# EAGLE design Evaluation_Board (EAGLE 6.5.0)
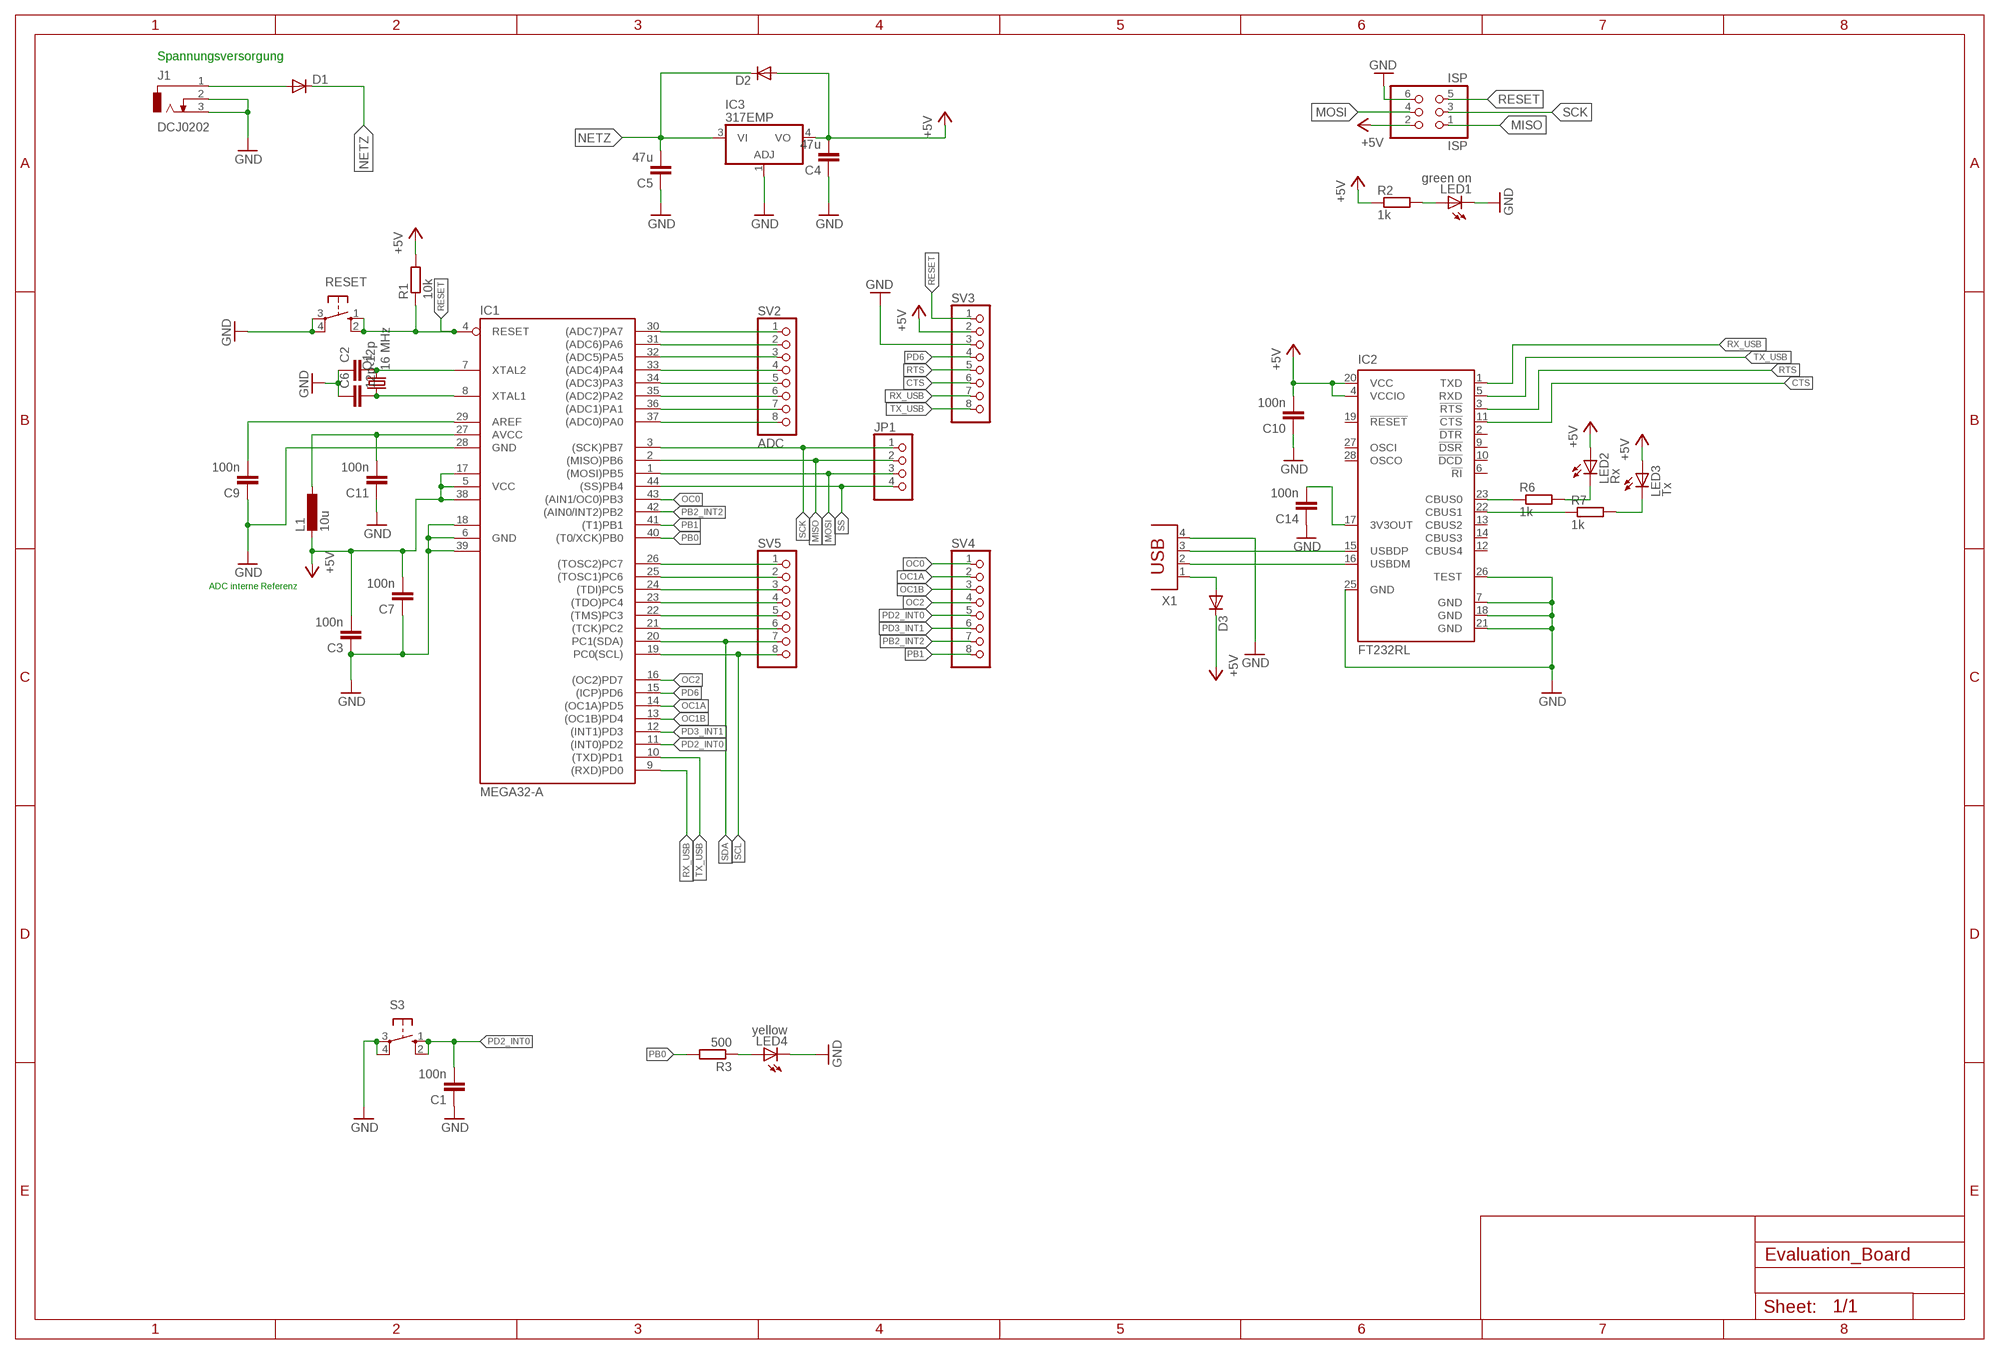
[diagram p0: schematic, sheet 1]

## Parts
C1  100n  C-EUC0805  [C0805]
C2  12p  C-EUC0805  [C0805]
C3  100n  C-EUC0805  [C0805]
C4  47u  C-EUC0805  [C0805]
C5  47u  C-EUC0805  [C0805]
C6  12p  C-EUC0805  [C0805]
C7  100n  C-EUC0805  [C0805]
C9  100n  C-EUC0805  [C0805]
C10  100n  C-EUC0805  [C0805]
C11  100n  C-EUC0805  [C0805]
C14  100n  C-EUC0805  [C0805]
D1  DIODE-MINIMELF  [MINIMELF]
D2  DIODE-MINIMELF  [MINIMELF]
D3  DIODE-MINIMELF  [MINIMELF]
IC1  MEGA32-A  [TQFP44]
IC2  FT232RL  [SSOP28]
IC3  317EMP  [SOT223]
ISP  ISP  PINHD-2X3  [2X03]
J1  DCJ0202  [DCJ0202]
JP1  PINHD-1X4  [1X04]
L1  10u  L-EUL3225M  [L3225M]
LED1  green on  LEDSML0805  [SML0805]
LED2  Rx  LEDSML0805  [SML0805]
LED3  Tx  LEDSML0805  [SML0805]
LED4  yellow  LEDSML0805  [SML0805]
Q1  16 MHz  CRYSTALHC49UP  [HC49UP]
R1  10k  R-EU_R0805  [R0805]
R2  1k  R-EU_R0805  [R0805]
R3  500  R-EU_R0805  [R0805]
R6  1k  R-EU_R0805  [R0805]
R7  1k  R-EU_R0805  [R0805]
RESET  10-XX  [B3F-10XX]
S3  10-XX  [B3F-10XX]
SV2  ADC  PINHD-1X8  [1X08]
SV3  PINHD-1X8  [1X08]
SV4  PINHD-1X8  [1X08]
SV5  PINHD-1X8  [1X08]
X1  USB-B-BUCHSE-HORIZONTAL  [USB-B-BUCHSE-HORIZONTAL]

## Nets
+5V: C3.2 C4.2 C7.2 C10.2 D2.A D3.C IC1.5(VCC) IC1.17(VCC1) IC1.38(VCC2) IC2.4(VCCIO) IC2.20(VCC) IC3.4(VO) ISP.2 L1.2 LED2.A LED3.A R1.2 R2.1 SV3.2
A0: IC1.37((ADC0)PA0) SV2.8
A1: IC1.36((ADC1)PA1) SV2.7
A2: IC1.35((ADC2)PA2) SV2.6
A3: IC1.34((ADC3)PA3) SV2.5
A4: IC1.33((ADC4)PA4) SV2.4
A5: IC1.32((ADC5)PA5) SV2.3
A6: IC1.31((ADC6)PA6) SV2.2
A7: IC1.30((ADC7)PA7) SV2.1
C2: IC1.21((TCK)PC2) SV5.6
C3: IC1.22((TMS)PC3) SV5.5
C4: IC1.23((TDO)PC4) SV5.4
C5: IC1.24((TDI)PC5) SV5.3
C6: IC1.25((TOSC1)PC6) SV5.2
C7: IC1.26((TOSC2)PC7) SV5.1
CTS: IC2.11(!CTS) SV3.6
GND: C1.1 C2.1 C3.1 C4.1 C5.1 C6.1 C7.1 C9.1 C10.1 C11.1 C14.1 IC1.6(GND) IC1.18(GND1) IC1.28(GND) IC1.39(GND2) IC2.7(GND) IC2.18(GND) IC2.21(GND) IC2.25(GND) IC2.26(TEST) IC3.1(ADJ) ISP.6 J1.2 J1.3 LED1.C LED4.C RESET.3(P) RESET.4(P1) S3.3(P) S3.4(P1) SV3.3 X1.4
MISO: IC1.2((MISO)PB6) ISP.1 JP1.2
MOSI: IC1.1((MOSI)PB5) ISP.4 JP1.3
N$1: D3.A X1.1
N$2: D1.A J1.1
N$4: IC2.23(CBUS0) R6.1
N$5: LED1.A R2.2
N$14: LED2.C R6.2
N$15: IC2.22(CBUS1) R7.1
N$16: LED3.C R7.2
N$17: C2.2 IC1.7(XTAL2) Q1.2
N$18: IC2.15(USBDP) X1.3
N$19: IC2.16(USBDM) X1.2
N$20: C14.2 IC2.17(3V3OUT)
N$25: C6.2 IC1.8(XTAL1) Q1.1
N$26: LED4.A R3.1
N$28: C9.2 IC1.29(AREF)
N$30: C11.2 IC1.27(AVCC) L1.1
NETZ: C5.2 D1.C D2.C IC3.3(VI)
OC0: IC1.43((AIN1/OC0)PB3) SV4.1
OC1A: IC1.14((OC1A)PD5) SV4.2
OC1B: IC1.13((OC1B)PD4) SV4.3
OC2: IC1.16((OC2)PD7) SV4.4
PB0: IC1.40((T0/XCK)PB0) R3.2
PB1: IC1.41((T1)PB1) SV4.8
PB2_INT2: IC1.42((AIN0/INT2)PB2) SV4.7
PD2_INT0: C1.2 IC1.11((INT0)PD2) S3.1(S) S3.2(S1) SV4.5
PD3_INT1: IC1.12((INT1)PD3) SV4.6
PD6: IC1.15((ICP)PD6) SV3.4
RESET: IC1.4(RESET) ISP.5 R1.1 RESET.1(S) RESET.2(S1) SV3.1
RTS: IC2.3(!RTS) SV3.5
RX_USB: IC1.9((RXD)PD0) IC2.1(TXD) SV3.7
SCK: IC1.3((SCK)PB7) ISP.3 JP1.1
SCL: IC1.19(PC0(SCL)) SV5.8
SDA: IC1.20(PC1(SDA)) SV5.7
SS: IC1.44((SS)PB4) JP1.4
TX_USB: IC1.10((TXD)PD1) IC2.5(RXD) SV3.8
Unconnected: IC2.2(!DTR) IC2.6(!RI) IC2.9(!DSR) IC2.10(!DCD) IC2.12(CBUS4) IC2.13(CBUS2) IC2.14(CBUS3) IC2.19(!RESET) IC2.27(OSCI) IC2.28(OSCO)

## Notes on the sheet
- Spannungsversorgung
- ADC interne Referenz

## Library data of the parts
C1-C7 C9-C11 C14 = rcl:C-EU: CAPACITOR, European symbol
D1-D3 = diode:DIODE-: DIODE
IC1 = atmel:MEGA32: MICROCONTROLLER 32 Kbytes FLASH 2 Kbytes SRAM 1 Kbytes EEPROM USART 8-channel 10 bit ADC Source: www.atmel.com .. doc2503.pdf; MPN: ATMEGA32-16AU; OC_FARNELL: 9171274; OC_NEWARK: 69K6677
IC2 = ftdichip:FT232R: Source: http://www.ftdichip.com/Documents/DataSheets/DS_FT232R_v104.pdf; MPN: FT232RL; OC_FARNELL: 1146032; OC_NEWARK: 91K9918
IC3 = linear:*317: Positive VOLTAGE REGULATOR
ISP = pinhead:PINHD-2X3: PIN HEADER
J1 = con-jack:DCJ0202: DC POWER JACK Source: DCJ0202.pdf; OC_FARNELL: unknown; OC_NEWARK: unknown
JP1 = pinhead:PINHD-1X4: PIN HEADER
L1 = rcl:L-EU: INDUCTOR, European symbol
LED1-LED4 = led:LED: LED OSRAM: - CHIPLED LG R971, LG N971, LY N971, LG Q971, LY Q971, LO R971, LY R971 LH N974, LH R974 LS Q976, LO Q976, LY Q976 LO Q996 - Hyper CHIPLED LW Q18S LB Q993, LB Q99A, LB R99A - SideLED LS A670, LO A670, LY A670, LG A670, LP A670 LB A673, LV A673, LT A673, LW A673 LH A674 LY A675 LS A676, LA A676, LO A676, LY A676, LW A676 LS A679, LY A679, LG A679 - Hyper Micro SIDELED® LS Y876, LA Y876, LO Y876, LY Y876 LT Y87S - SmartLED LW L88C, LW L88S LB L89C, LB L89S, LG L890 LS L89K, LO L89K, LY L89K LS L896, LA L896, LO L896, LY L896 - TOPLED LS T670, LO T670, LY T670, LG T670, LP T670 LSG T670, LSP T670, LSY T670, LOP T670, LYG T670 LG T671, LOG T671, LSG T671 LB T673, LV T673, LT T673, LW T673 LH T674 LS T676, LA T676, LO T676, LY T676, LB T676, LH T676, LSB T676, LW T676 LB T67C, LV T67C, LT T67C, LS T67K, LO T67K, LY T67K, LW E67C LS E67B, LA E67B, LO E67B, LY E67B, LB E67C, LV E67C, LT E67C LW T67C LS T679, LY T679, LG T679 LS T770, LO T770, LY T770, LG T770, LP T770 LB T773, LV T773, LT T773, LW T773 LH T774 LS E675, LA E675, LY E675, LS T675 LS T776, LA T776, LO T776, LY T776, LB T776 LHGB T686 LT T68C, LB T68C - Hyper Mini TOPLED® LB M676 - Mini TOPLED Santana® LG M470 LS M47K, LO M47K, LY M47K Source: http://www.osram.convergy.de LUXEON: - LUMILED® LXK2-PW12-R00, LXK2-PW12-S00, LXK2-PW14-U00, LXK2-PW14-V00 LXK2-PM12-R00, LXK2-PM12-S00, LXK2-PM14-U00 LXK2-PE12-Q00, LXK2-PE12-R00, LXK2-PE12-S00, LXK2-PE14-T00, LXK2-PE14-U00 LXK2-PB12-K00, LXK2-PB12-L00, LXK2-PB12-M00, LXK2-PB14-N00, LXK2-PB14-P00, LXK2-PB14-Q00 LXK2-PR12-L00, LXK2-PR12-M00, LXK2-PR14-Q00, LXK2-PR14-R00 LXK2-PD12-Q00, LXK2-PD12-R00, LXK2-PD12-S00 LXK2-PH12-R00, LXK2-PH12-S00 LXK2-PL12-P00, LXK2-PL12-Q00, LXK2-PL12-R00 Source: www.luxeon.com KINGBRIGHT: KA-3528ASYC Source: www.kingbright.com
Q1 = crystal:CRYSTAL: CRYSTAL; OC_FARNELL: unknown; OC_NEWARK: unknown
R1-R3 R6 R7 = rcl:R-EU_: RESISTOR, European symbol
RESET S3 = switch-omron:10-XX: OMRON SWITCH; MPN: B3F-1000; OC_FARNELL: 176432; OC_NEWARK: 36M3542
SV2-SV5 = pinhead:PINHD-1X8: PIN HEADER
X1 = EmbeddedProjectsBauteile:USB-B-BUCHSE-HORIZONTAL: liegende Ausführung

## Board
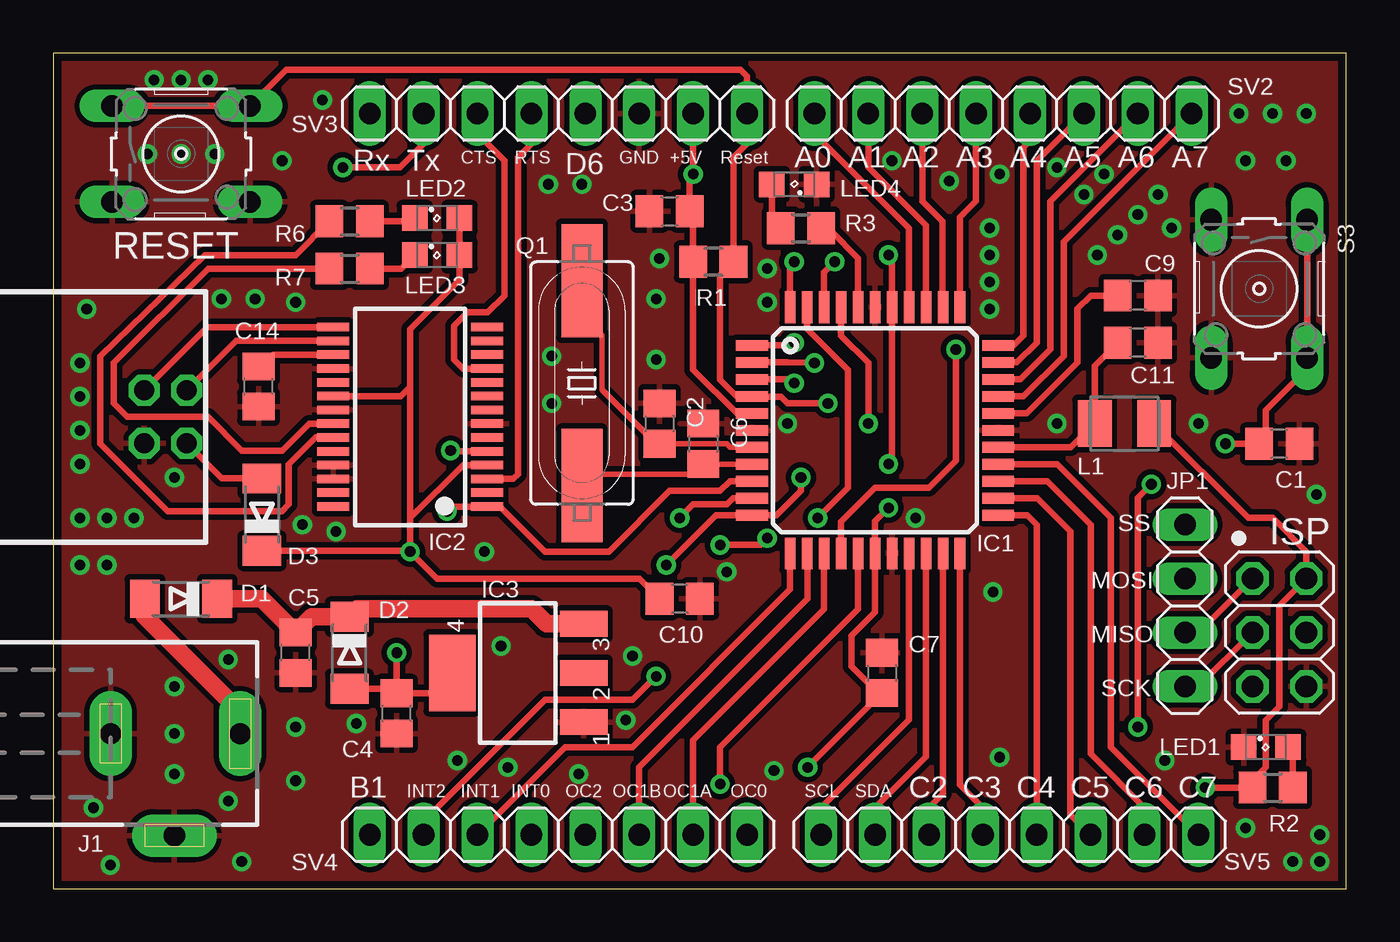
[diagram p1: board, top side]
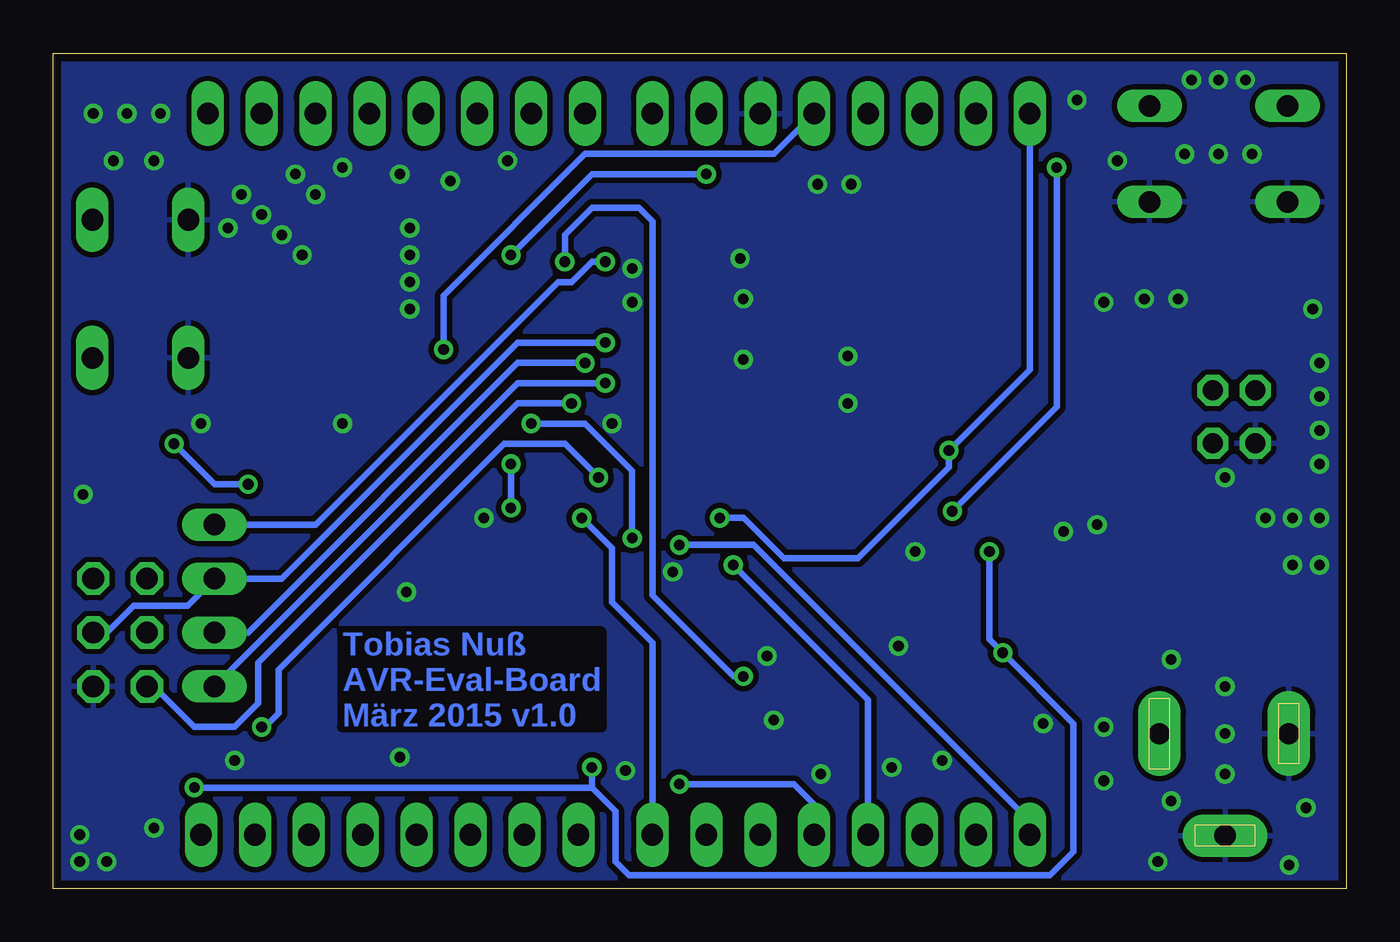
[diagram p2: board, bottom side, seen from below]

Size 60.95 x 39.36 mm. Coordinates in mm from the lower left corner, seen from the top.
Outline: 0,0 60.95,0 60.95,39.36 0,39.36 0,0
Copper layers (1*16): Top 0.035mm / dielectric 1.5mm / Bottom 0.035mm
Design rules "osh-park": minimum track width 6mil, minimum drill 13mil, track to track 6mil, track to pad 6mil, pad to pad 8mil, via to via 8mil, smd to smd 8mil, copper to edge 15mil, drill to drill 7mil, minimum pad ring 10mil, minimum via ring 8mil, stop-mask expansion 4mil, vias tented up to drill 0mil, thermal gap 10mil

### Footprints (pad centres in the part's own frame; a part is rotated, then mirrored left to right if it is on the bottom)
C0805 = smd 1.3 x 1.5: 1 -0.95,0; 2 0.95,0
MINIMELF = smd 1.4 x 1.8: A 1.7,0; C -1.7,0
TQFP44 = smd 1.5 x 0.5: 1 -5.8,4; 2 -5.8,3.2; 3 -5.8,2.4; 4 -5.8,1.6; 5 -5.8,0.8; 6 -5.8,0; 7 -5.8,-0.8; 8 -5.8,-1.6; 9 -5.8,-2.4; 10 -5.8,-3.2; 11 -5.8,-4; 23 5.8,-4; 24 5.8,-3.2; 25 5.8,-2.4; 26 5.8,-1.6; 27 5.8,-0.8; 28 5.8,0; 29 5.8,0.8; 30 5.8,1.6; 31 5.8,2.4; 32 5.8,3.2; 33 5.8,4 | smd 0.5 x 1.5: 12 -4,-5.8; 13 -3.2,-5.8; 14 -2.4,-5.8; 15 -1.6,-5.8; 16 -0.8,-5.8; 17 0,-5.8; 18 0.8,-5.8; 19 1.6,-5.8; 20 2.4,-5.8; 21 3.2,-5.8; 22 4,-5.8; 34 4,5.8; 35 3.2,5.8; 36 2.4,5.8; 37 1.6,5.8; 38 0.8,5.8; 39 0,5.8; 40 -0.8,5.8; 41 -1.6,5.8; 42 -2.4,5.8; 43 -3.2,5.8; 44 -4,5.8
SSOP28 = smd 0.4 x 1.5: 1 -4.225,-3.625; 2 -3.575,-3.625; 3 -2.925,-3.625; 4 -2.275,-3.625; 5 -1.625,-3.625; 6 -0.975,-3.625; 7 -0.325,-3.625; 8 0.325,-3.625; 9 0.975,-3.625; 10 1.625,-3.625; 11 2.275,-3.625; 12 2.925,-3.625; 13 3.575,-3.625; 14 4.225,-3.625; 15 4.225,3.625; 16 3.575,3.625; 17 2.925,3.625; 18 2.275,3.625; 19 1.625,3.625; 20 0.975,3.625; 21 0.325,3.625; 22 -0.325,3.625; 23 -0.975,3.625; 24 -1.625,3.625; 25 -2.275,3.625; 26 -2.925,3.625; 27 -3.575,3.625; 28 -4.225,3.625
SOT223 = smd 1.219 x 2.235: 1 -2.311,-3.099; 2 0,-3.099; 3 2.311,-3.099 | smd 3.6 x 2.2: 4 0,3.099
2X03 = drill 1.016 octagon: 1 -2.54,-1.27; 2 -2.54,1.27; 3 0,-1.27; 4 0,1.27; 5 2.54,-1.27; 6 2.54,1.27
DCJ0202 = drill 1 pad 2 long: 1 0,3.1; 2 4.8,0; 3 0,-3
1X04 = drill 1.016 long: 1 -3.81,0; 2 -1.27,0; 3 1.27,0; 4 3.81,0
L3225M = smd 1.6 x 2.2: 1 -1.4,0; 2 1.4,0
SML0805 = smd 1.2 x 1.2: A 1.05,0; C -1.05,0
HC49UP = smd 5.334 x 1.93: 1 -4.826,0; 2 4.826,0
R0805 = smd 1.3 x 1.5: 1 -0.95,0; 2 0.95,0
B3F-10XX = drill 1.016 long: 1 -3.251,2.261; 2 3.251,2.261; 3 -3.251,-2.261; 4 3.251,-2.261
1X08 = drill 1.016 long: 1 -8.89,0; 2 -6.35,0; 3 -3.81,0; 4 -1.27,0; 5 1.27,0; 6 3.81,0; 7 6.35,0; 8 8.89,0
USB-B-BUCHSE-HORIZONTAL = drill 0.95 octagon: 1 1.25,9.79; 2 -1.25,9.79; 3 -1.25,7.79; 4 1.25,7.79

### Placement (x,y rotation side)
C1  57.78,20.95 180 top
C2  28.57,21.91 270 top
C3  29.05,31.91 0 top
C4  16.19,8.26 90 top
C5  11.43,11.11 90 top
C6  30.64,20.95 270 top
C7  39.05,10.16 270 top
C9  51.12,27.94 180 top
C10  29.53,13.65 180 top
C11  51.12,25.72 180 top
C14  9.68,23.65 90 top
D1  6.03,13.65 180 top
D2  13.97,11.11 270 top
D3  9.84,17.62 90 top
IC1  38.73,21.59 0 top
IC2  16.83,22.23 90 top
IC3  21.91,10.16 90 top
ISP  57.78,12.06 270 top
J1  5.71,7.3 270 top
JP1  53.34,13.34 90 top
L1  50.48,21.91 0 top
LED1  57.15,6.67 0 top
LED2  18.1,31.59 0 top
LED3  18.1,29.84 0 top
LED4  34.92,33.18 180 top
Q1  24.92,23.81 90 top
R1  31.11,29.53 180 top
R2  57.47,4.76 0 top
R3  35.24,31.11 0 top
R6  13.97,31.43 0 top
R7  13.97,29.21 0 top
RESET  6.03,34.61 0 top
S3  56.83,28.26 270 top
SV2  44.77,36.51 180 top
SV3  23.81,36.51 180 top
SV4  23.81,2.54 180 top
SV5  45.09,2.54 180 top
X1  -3.49,22.23 270 top

### Tracks (layer width: path | path; a pad name or v marks a point on that pad's centre or on a via)
+5V  (via drill 0.5)
  Top 0.305: IC2.4 19.32,19.95 16.83,17.46 | 16.83,17.46 v16.83,15.88 | LED2.A LED3.A 19.15,28.67 16.83,26.35 16.83,23.65 | 16.83,23.65 16.83,17.46 | L1.2 56.33,17.46 57.47,17.46 59.05,15.88 ISP.2 57.78,13.34 57.78,8.57 57.15,7.94 57.15,5.71 56.52,5.08 R2.1 v54.29,4.76 | v39.37,17.94 38.73,17.3 IC1.17 38.73,13.02 37.62,11.91 37.62,10.48 38.42,9.68 38.58,9.68 C7.2 38.73,8.89 v35.56,5.71 | v39.37,20 39.53,20.17 IC1.38 39.53,29.68 v39.37,29.84 | IC1.5 32.22,22.39 30.16,24.45 R1.2 30.16,31.75 C3.2 | SV3.2 v30.16,33.66 30,33.49 C3.2 | C4.2 17.85,9.21 IC3.4 | IC2.20 16.37,23.2 16.83,23.65 | D2.A 15.98,9.41 C4.2 | D3.C 16.78,15.92 v16.83,15.88 | v16.19,11.11 C4.2 | v16.83,15.88 18.1,14.61 27.62,14.61 C10.2 | 30.16,31.75 C3.2
  Bottom 0.305: 35.56,4.76 v54.29,4.76 | v30.16,33.66 35.56,33.66 v39.37,29.84 | v39.37,17.94 v39.37,20 | v16.83,15.88 16.83,11.75 v16.19,11.11 12.86,7.78 12.86,1.75 13.97,0.64 33.81,0.64 34.45,1.27 34.45,3.65 35.56,4.76 | v35.56,5.71 35.56,4.76
A0
  Top 0.305: SV2.8 35.88,35.56 40.32,31.11 40.32,27.4 IC1.37
A1
  Top 0.305: SV2.7 38.42,33.97 41.13,31.25 IC1.36
A2
  Top 0.305: SV2.6 40.96,32.38 41.91,31.43 41.91,27.41 IC1.35
A3
  Top 0.305: SV2.5 43.5,32.38 42.73,31.62 IC1.34
A4
  Top 0.305: SV2.4 46.04,35.24 45.72,34.92 45.72,26.04 45.27,25.59 IC1.33
A5
  Top 0.305: IC1.32 45.43,24.79 46.35,25.72 46.35,34.29 SV2.3
A6
  Top 0.305: IC1.31 45.58,23.99 46.99,25.4 46.99,32.38 SV2.2
A7
  Top 0.305: IC1.30 45.73,23.19 47.62,25.08 47.62,30.48 SV2.1
C2
  Top 0.305: SV5.6 41.27,3.81 41.94,4.47 IC1.21
C3
  Top 0.305: IC1.22 42.73,4.89 43.81,3.81 SV5.5
C4
  Top 0.305: IC1.23 45.91,17.59 46.35,17.14 SV5.4
C5
  Top 0.305: IC1.24 46.38,18.39 47.94,16.83 47.94,3.49 SV5.3
C6
  Top 0.305: IC1.25 46.85,19.19 48.9,17.14 48.9,6.35 51.44,3.81 SV5.2
C7
  Top 0.305: IC1.26 47.32,19.99 49.85,17.46 49.85,6.67 SV5.1
CTS
  Top 0.305: IC2.11 19.32,24.5 18.89,24.92 18.89,26.51 19.53,27.15 20.48,27.15 21.27,27.94 21.27,34.29 20,35.56 SV3.6
GND  (via drill 0.5)
  other vias: 11.43,7.62 11.43,5.08 11.75,17.14 7.94,27.78 9.53,27.78 11.43,27.62 44.13,27.3 44.13,28.57 44.13,29.84 44.13,31.11 42.23,33.34 39.53,34.29 48.58,32.7 47.31,33.97 47.31,21.91 52.39,6.03 24.77,5.4 21.43,5.71 53.98,21.91 49.21,29.84 50.16,30.8 51.12,31.75 52.07,32.7 52.7,31.11 55.88,36.51 56.2,34.29 58.1,34.29 59.05,36.51 57.47,36.51 56.2,2.86 2.7,1.11 5.71,9.53 5.71,5.4 5.71,7.3 5.71,19.37 4.45,34.61 6.03,34.61 7.62,34.61 10.79,34.29 12.7,37.15 1.59,27.3 1.27,24.77 1.27,23.18 1.27,21.59 1.27,17.46 3.81,17.46 1.27,20 2.54,17.46 8.26,10.79 8.26,4.13 1.91,3.81 19.05,6.03 26.99,7.94 27.3,10.95 33.66,29.21 44.61,33.66 49.53,33.66 59.53,18.57 59.69,2.54 59.69,1.27 58.42,1.27 8.89,1.27 14.29,7.78 1.27,15.24 2.54,15.24 13.34,16.83 4.76,38.1 6.03,38.1 7.3,38.1 33.66,27.62 31.75,14.92 34.61,21.91 40.64,17.46 28.42,24.92 28.42,27.78 28.57,29.69 23.5,25.08 23.5,22.86 20.32,15.88 23.34,33.18 24.92,33.18 21.11,11.43 44.29,13.97 33.97,5.56 44.61,6.19
  pour Bottom (isolate 0.254): 0,39.37 60.96,39.37 60.96,0 0,0
  pour Top (isolate 0.254): 0,39.37 60.96,39.37 60.96,0 0,0
MISO  (via drill 0.5)
  Top 0.305: JP1.2 53.98,12.06 ISP.1 | IC1.2 34.58,24.79 v35.88,24.77
  Bottom 0.305: JP1.2 51.75,12.06 39.05,24.77 v35.88,24.77
MOSI  (via drill 0.5)
  Top 0.305: IC1.1 34.8,25.59 v34.92,25.72
  Bottom 0.305: ISP.4 58.42,12.06 57.15,13.34 54.61,13.34 JP1.3 50.16,14.61 39.05,25.72 v34.92,25.72
N$1
  Top 0.305: D3.A 7.95,19.32 X1.1
N$2
  Top 0.813: J1.1 8.81,8.33 4.29,12.86 4.29,13.61 D1.A
N$4
  Top 0.305: R6.1 11.43,29.84 7.14,29.84 2.22,25.08 2.22,20.95 5.4,17.78 10.79,17.78 11.11,18.1 11.11,20 12.38,21.27 13.18,21.27 IC2.23
N$5
  Top 0.305: R2.2 58.42,6.45 LED1.A
N$14
  Top 0.305: R6.2 16.89,31.43 LED2.C
N$15
  Top 0.305: R7.1 7.3,29.21 2.86,24.77 2.86,22.86 3.49,22.23 7.3,22.23 8.89,20.64 10.79,20.64 12.06,21.91 IC2.22
N$16
  Top 0.305: R7.2 16.41,29.21 LED3.C
N$17
  Top 0.254: 28.58,20.79 C2.2 | C2.2 28.41,20.96 25.88,23.5 25.88,26.04 25.4,26.51 25.4,28.16 Q1.2 | C2.2 31.75,20.96 31.91,20.8 IC1.7
N$18
  Top 0.305: X1.3 7.27,26.45 IC2.15
N$19
  Top 0.305: X1.2 8.62,25.8 IC2.16
N$20
  Top 0.305: IC2.17 10.39,25.15 C14.2
N$25
  Top 0.254: IC1.8 30.94,19.99 C6.2 30.8,19.68 30.64,19.53 25.46,19.53 Q1.1
N$26
  Top 0.305: R3.1 33.88,31.85 LED4.A
N$28
  Top 0.305: IC1.29 45.88,22.39 48.26,24.77 48.26,27.3 48.9,27.94 C9.2
N$30
  Top 0.305: IC1.27 47.97,20.79 L1.1 49.08,24.63 C11.2
NETZ
  Top 0.305: 25.72,12.38 25.63,12.47 IC3.3 | 13.77,13.02 D2.C 14.18,13.02
  Top 0.813: D1.C 9.84,13.65 C5.2 12.18,12.81 D2.C | 14.18,13.02 14.33,13.18 22.54,13.18 23.25,12.47 IC3.3
OC0  (via drill 0.5)
  Top 0.305: IC1.43 35.53,26.38 37.47,24.45 37.47,18.89 v36.04,17.46
  Bottom 0.305: SV4.1 32.7,11.59 34.61,13.49 34.61,16.03 v36.04,17.46
OC1A
  Top 0.305: IC1.14 36.34,13.16 30.16,6.99 SV4.2
OC1B
  Top 0.305: SV4.3 27.62,5.71 35.56,13.65 35.56,15.77 IC1.13
OC2  (via drill 0.5)
  Top 0.305: IC1.16 37.94,13.17 31.43,6.67 v31.43,4.92
  Bottom 0.305: v31.43,4.92 26.04,4.92 25.08,3.97 SV4.4
PB0
  Top 0.305: IC1.40 37.94,29.69 36.67,30.96 R3.2
PB1  (via drill 0.5)
  Top 0.305: IC1.41 37.13,26.05 38.42,24.77 v38.42,21.91 | v31.43,16.19 33.34,16.19 v33.66,16.51
  Bottom 0.305: SV4.8 14.92,3.17 27.94,16.19 v31.43,16.19 | v33.66,16.51 33.66,19.68 35.88,21.91 v38.42,21.91
PB2_INT2  (via drill 0.5)
  Top 0.305: SV4.7 17.46,3.17 23.18,8.89 27.3,8.89 v28.42,10 | IC1.42 36.34,29.03 v36.83,29.53
  Bottom 0.305: v36.83,29.53 36.83,30.8 35.56,32.07 33.34,32.07 32.7,31.43 32.7,13.81 28.89,10 v28.42,10
PD2_INT0  (via drill 0.5)
  Top 0.305: S3.1 S3.2 59.09,24.49 57.15,22.54 57.15,21.27 C1.2 v55.24,20.95 | v51.75,19.05 51.12,18.41 v51.12,7.62 | v28.89,15.24 31.24,17.59 IC1.11 34.1,17.59 35.24,18.73 v35.24,19.37
  Bottom 0.305: SV4.5 22.54,8.89 v28.89,15.24 | v55.24,20.95 53.34,19.05 v51.75,19.05 | v35.24,19.37 36.83,20.95 39.69,20.95 50.32,10.32 50.32,8.26 50.96,7.62 v51.12,7.62
PD3_INT1
  Top 0.305: SV4.6 24.13,6.67 27.3,6.67 34.73,14.1 IC1.12
PD6  (via drill 0.5)
  Top 0.305: 37.15,15.8 IC1.15 37.13,17.29 38.73,18.89 41.27,18.89 42.55,20.16 v42.55,25.4
  Bottom 0.305: SV3.4 26.99,34.61 35.88,34.61 42.55,27.94 v42.55,25.4
RESET  (via drill 0.5)
  Top 0.305: RESET.1 RESET.2 10.99,38.58 32.38,38.58 32.7,38.26 SV3.1 32.7,35.08 32.06,34.45 R1.1 31.43,28.89 31.43,23.97 32.21,23.19 IC1.4 32.95,23.18 34.29,23.18 34.61,22.86 v36.51,22.86
  Bottom 0.305: ISP.5 56.2,9.53 54.29,7.62 52.39,7.62 51.28,8.73 51.28,10.64 39.05,22.86 v36.51,22.86
RTS
  Top 0.305: IC2.3 21.68,19.3 21.91,19.53 21.91,34.45 22.54,35.08 SV3.5
RX_USB  (via drill 0.5)
  Top 0.305: IC1.9 31.89,19.19 31.43,18.73 29.05,18.73 26.19,15.88 23.18,15.88 21.11,17.94 20.51,17.94 IC2.1 18.79,18 v18.57,17.78 | v13.65,33.97 16.35,33.97 17.46,35.08 SV3.7
  Bottom 0.305: v18.57,17.78 13.65,22.7 v13.65,33.97
SCK  (via drill 0.5)
  Top 0.305: JP1.1 53.98,9.53 ISP.3 | IC1.3 34.75,23.99 v34.92,23.81
  Bottom 0.305: JP1.1 39.05,23.81 v34.92,23.81
SCL
  Top 0.305: IC1.19 40.34,7.95 36.2,3.81 SV5.8
SDA
  Top 0.305: SV5.7 38.73,3.81 41.13,6.21 IC1.20
SS  (via drill 0.5)
  Top 0.305: IC1.44 34.73,29.34 v34.92,29.53
  Bottom 0.305: JP1.4 48.58,17.14 37.15,28.57 36.51,28.57 35.56,29.53 v34.92,29.53
TX_USB  (via drill 0.5)
  Top 0.305: IC2.5 18.77,20.6 v18.73,20.64 | 29.69,17.62 v29.53,17.46 30.16,18.1 31.75,18.1 32.04,18.39 IC1.10
  Bottom 0.305: v29.53,17.46 28.42,17.46 26.51,15.56 23.02,15.56 18.73,19.84 v18.73,20.64 14.92,24.45 SV3.8

### Text on the board
Bottom: Tobias Nuß / AVR-Eval-Board / März 2015 v1.0
tNames: Rx | Tx | CTS | RTS | D6 | GND | +5V | Reset | A0 | A1 | A2 | A3 | A4 | A5 | A6 | A7 | SS | MOSI | MISO | SCK | B1 | INT2 | INT1 | INT0 | OC2 | OC1B | OC1A | OC0 | SCL | SDA | C2 | C3 | C4 | C5 | C6 | C7
bStop: Tobias Nuß / AVR-Eval-Board / März 2015 v1.0